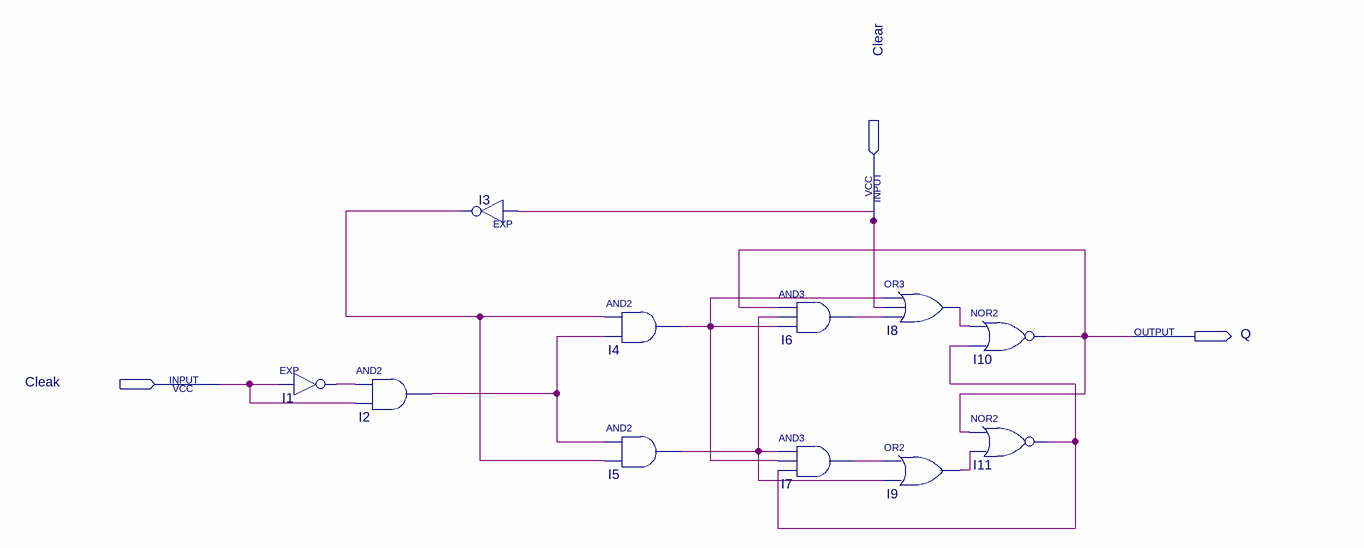
[diagram p0: schematic sheet]
// Quartus schematic FlipFlop-JK.bdf as structural Verilog: 11 symbols, 3 pins
module \FlipFlop-JK  (
  input  Clear,
  input  Cleak,
  output Q
);

  wire I1_out, I2_out, I3_out, I4_out, I5_out, I6_out, I7_out, I8_out, I9_out, I11_out;

  EXP I1 (.IN(Cleak), .OUT(I1_out));
  and I2 (I2_out, I1_out, Cleak);
  EXP I3 (.IN(Clear), .OUT(I3_out));
  and I4 (I4_out, I3_out, I2_out);
  and I5 (I5_out, I2_out, I3_out);
  and I6 (I6_out, Q, I5_out, I4_out);
  and I7 (I7_out, I5_out, I4_out, I11_out);
  or I8 (I8_out, I4_out, Clear, I6_out);
  or I9 (I9_out, I7_out, I5_out);
  nor I10 (Q, I8_out, I11_out);
  nor I11 (I11_out, Q, I9_out);
endmodule
